# EAGLE design usb_breakout_1.0 (EAGLE 5.10)
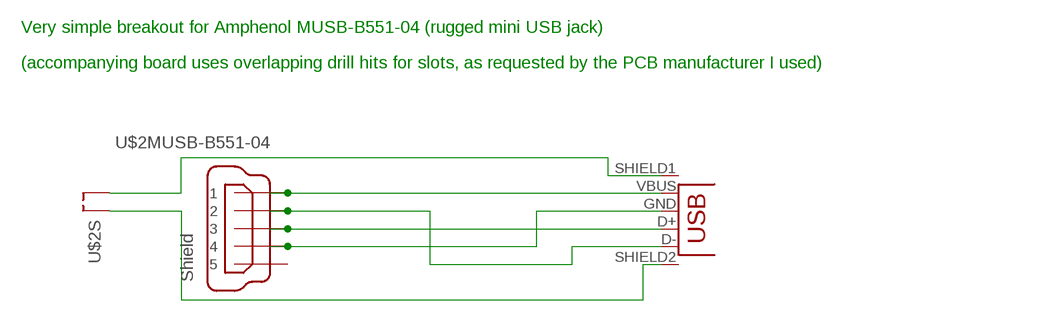
[diagram p0: schematic, sheet 1]

## Parts
U$2  Shield  AMPHENOL_USB_OVERLAPPING_DRILL_SLOTOVERLAPPINGDRILLHITS  [32005-601]
X1  USBSPARKFUN-A-H  [USB-A-H]

## Nets
N$1: U$2.1 X1.VBUS(GND)
N$2: U$2.M1(S:S1) X1.SHIELD1
N$3: U$2.3 X1.D+(D-)
N$4: U$2.M2(S:S2) X1.SHIELD2
N$5: U$2.4 X1.GND(VBUS)
N$7: U$2.2 X1.D-(D+)
Unconnected: U$2.5

## Notes on the sheet
- Very simple breakout for Amphenol MUSB-B551-04 (rugged mini USB jack)
- (accompanying board uses overlapping drill hits for slots, as requested by the PCB manufacturer I used)

## Library data of the parts
U$2 = !parts_I_built:AMPHENOL_USB_OVERLAPPING_DRILL_SLOT: MUSB-B551-04
X1 = !parts_I_built:USBSPARKFUN: USB Connectors USB-B-PTH is fully proven SKU : PRT-00139 USB-miniB is fully proven SKU : PRT-00587 USB-A-PCB is untested. USB-A-H is throughly reviewed, but untested. Spark Fun Electronics SKU : PRT-00437 USB-B-SMT is throughly reviewed, but untested. Needs silkscreen touching up. USB-A-S has not been used/tested USB-MB-H has not been used/tested

## Board
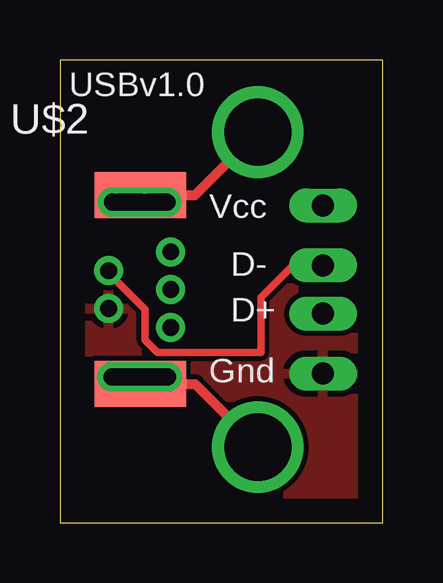
[diagram p1: board, top side]
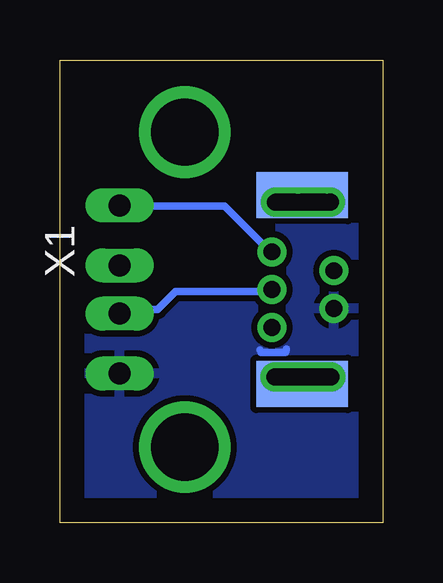
[diagram p2: board, bottom side, seen from below]

Size 13.46 x 19.3 mm. Coordinates in mm from the lower left corner, seen from the top.
Outline: 0,0 13.46,0 13.46,19.3 0,19.3 0,0
Copper layers (1*16): Top 0.035mm / dielectric 1.5mm / Bottom 0.035mm
Design rules "default *": minimum track width 12mil, minimum drill 24mil, track to track 8mil, track to pad 8mil, pad to pad 8mil, via to via 8mil, smd to smd 8mil, copper to edge 40mil, drill to drill 8mil, minimum pad ring 10mil, minimum via ring 8mil, stop-mask expansion 4mil, vias tented up to drill 0mil, thermal gap 10mil

### Footprints (pad centres in the part's own frame; a part is rotated, then mirrored left to right if it is on the bottom)
32005-601 = drill 0.7 pad 1.016 round: 1 2.591,1.575; 2 0,0.787; 3 2.591,0; 4 0,-0.787; 5 2.591,-1.575 | smd 3.81 x 1.93: M1 1.327,3.937; M2 1.327,-3.937 | smd 3.81 x 1.93 bottom: M3 1.327,-3.937; M4 1.327,3.937 | drill 0.7 round: P$1 0.132,-3.646; P$2 0.155,3.643; P$3 2.446,3.642; P$4 0.299,3.641; P$5 0.443,3.645; P$6 0.555,3.644; P$7 0.669,3.645; P$8 0.787,3.644; P$9 0.877,3.646; P$10 0.967,3.649; P$11 1.039,3.645; P$12 1.129,3.648; P$13 1.229,3.645; P$14 1.323,3.643; P$15 1.423,3.642; P$16 1.514,3.642; P$17 1.591,3.642; P$18 1.695,3.645; P$19 1.769,3.642; P$20 1.821,3.645; P$21 1.911,3.645; P$22 1.988,3.645; P$23 2.069,3.648; P$24 2.136,3.644; P$25 2.21,3.646; P$26 2.275,3.645; P$27 2.354,3.647; P$28 2.411,3.645; P$29 0.199,-3.643; P$30 0.281,-3.644; P$31 0.381,-3.644; P$32 0.462,-3.646; P$33 0.554,-3.644; P$34 0.652,-3.646; P$35 0.738,-3.646; P$36 0.835,-3.649; P$37 0.928,-3.646; P$38 1.018,-3.646; P$39 1.101,-3.644; P$40 1.194,-3.646; P$41 1.292,-3.641; P$42 1.367,-3.646; P$43 1.455,-3.644; P$44 1.541,-3.644; P$45 1.648,-3.644; P$46 1.753,-3.644; P$47 1.836,-3.644; P$48 1.917,-3.646; P$49 2.005,-3.644; P$50 2.078,-3.644; P$51 2.159,-3.644; P$52 2.237,-3.641; P$53 2.317,-3.641; P$54 2.383,-3.644; P$55 2.461,-3.646
USB-A-H = drill 0.914 pad 1.422 long: D+ 2.718,1.003; D- 2.718,-1.003; GND 2.718,3.505; VBUS 2.718,-3.505 | drill 2.8 round: SHIELD1 0,-6.566; SHIELD2 0,6.566

### Placement (x,y rotation side)
U$2  2.03,9.73 0 top
X1  8.26,9.73 180 bottom

### Tracks (layer width: path | path; a pad name or v marks a point on that pad's centre or on a via)
N$1
  Bottom 0.305: U$2.1 4.83,11.43 6.6,13.21 10.92,13.21 X1.VBUS
N$2
  Top 0.406: U$2.M1 5.63,13.66 X1.SHIELD1
N$3
  Bottom 0.305: U$2.3 4.83,9.65 8.64,9.65 9.4,8.89 10.92,8.89 X1.D+
N$4
  Top 0.406: U$2.M2 5.63,5.79 X1.SHIELD2
N$5
  Bottom 0.305: 4.02,7.25 4.06,7.11 5.08,7.11 5.13,7.21
  pour Top (isolate 0.203): 0.25,19.05 0.25,0.51 13.21,0.51 13.21,19.05
  pour Bottom (isolate 0.254): 0.51,19.05 0.51,0.51 13.21,0.51 13.21,19.05
N$7
  Top 0.305: U$2.2 2.03,10.41 3.56,8.89 3.56,7.62 4.06,7.11 8.38,7.11 8.38,9.4 9.65,10.67 10.92,10.67 X1.D-

### Text on the board
tPlace: USBv1.0 | Vcc | D- | D+ | Gnd